# EasyEDA schematic Intelligent 7-Segment Display.json
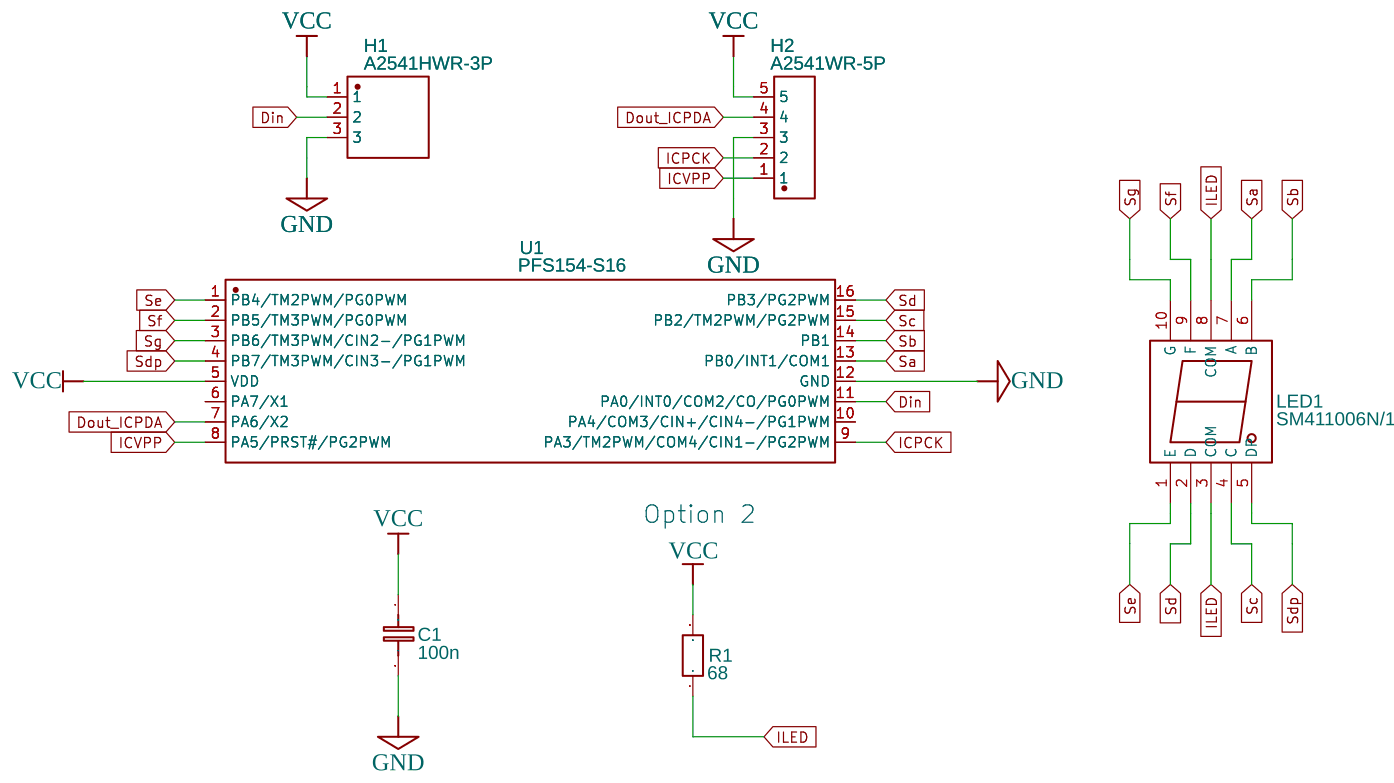
[diagram p0: schematic sheet]

## Parts
C1  100n  [0805]
H1  A2541HWR-3P  [A2541HWR-3P]
H2  A2541WR-5P  [HDR-TH_5P-P2.54-H-W10.0]
LED1  SM411006N/15  [LED-SEG-TH_10P-L24.0-W34.0-P2.54-S30.48-BL]
R1  68  [0805]
U1  PFS154-S16  [SOP-16_L10.0-W3.9-P1.27-LS6.0-BL]

## Library data of the parts
C1 = Cap_0805_EU
H1 = A2541HWR-3P: Supplier: LCSC; Supplier Part: C225511; Manufacturer: Changjiang Connectors; Contributor: LCSC
H2 = A2541WR-5P: Supplier: LCSC; Supplier Part: C225491; Manufacturer: Changjiang Connectors; Contributor: LCSC
LED1 = SM411006N/15: Supplier: LCSC; Supplier Part: C252204; Manufacturer: Wuxi ARK Tech Elec; Contributor: LCSC
R1 = Res_0805(1/8W)_EU
U1 = PFS154-S16: Supplier: LCSC; Supplier Part: C317613; Manufacturer: PADAUK Tech; Contributor: LCSC

## Nets
GND: C1.2 H1.3 H2.3 U1.12(GND)
VCC: C1.1 H1.1 H2.5 R1.2 U1.5(VDD)
Din: H1.2 U1.11(PA0/INT0/COM2/CO/PG0PWM)
Dout_ICPDA: H2.4 U1.7(PA6/X2)
ICPCK: H2.2 U1.9(PA3/TM2PWM/COM4/CIN1-/PG2PWM)
ICVPP: H2.1 U1.8(PA5/PRST#/PG2PWM)
ILED: LED1.3(COM) LED1.8(COM) R1.1
Sa: LED1.7(A) U1.13(PB0/INT1/COM1)
Sb: LED1.6(B) U1.14(PB1)
Sc: LED1.4(C) U1.15(PB2/TM2PWM/PG2PWM)
Sd: LED1.2(D) U1.16(PB3/PG2PWM)
Sdp: LED1.5(DP) U1.4(PB7/TM3PWM/CIN3-/PG1PWM)
Se: LED1.1(E) U1.1(PB4/TM2PWM/PG0PWM)
Sf: LED1.9(F) U1.2(PB5/TM3PWM/PG0PWM)
Sg: LED1.10(G) U1.3(PB6/TM3PWM/CIN2-/PG1PWM)

Not connected (* = marked no-connect by the designer): U1 6(PA7/X1) 10(PA4/COM3/CIN+/CIN4-/PG1PWM)

## Notes on the sheet
- Option 2
